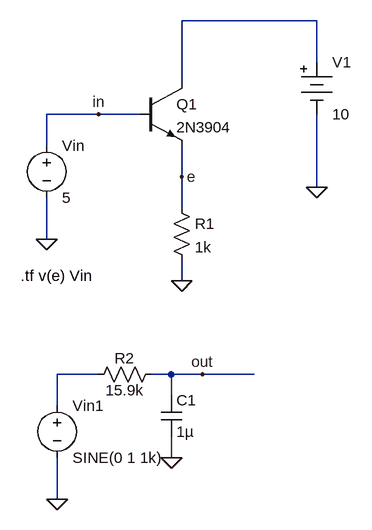
[diagram p0: schematic transfer_function_test.asc]
transfer_function_test.asc, the LTspice schematic file:
Version 4
SHEET 1 880 788
WIRE 448 32 240 32
WIRE 448 96 448 32
WIRE 240 128 240 32
WIRE 112 176 32 176
WIRE 176 176 112 176
WIRE 32 224 32 176
WIRE 240 272 240 224
WIRE 448 288 448 176
WIRE 240 320 240 272
WIRE 32 368 32 304
WIRE 240 432 240 400
WIRE 112 576 48 576
WIRE 224 576 192 576
WIRE 272 576 224 576
WIRE 352 576 272 576
WIRE 224 608 224 576
WIRE 48 624 48 576
WIRE 224 704 224 672
WIRE 48 768 48 704
FLAG 240 432 0
FLAG 448 288 0
FLAG 240 272 e
FLAG 32 368 0
FLAG 224 704 0
FLAG 112 176 in
FLAG 48 768 0
FLAG 272 576 out
SYMBOL npn 176 128 R0
SYMATTR InstName Q1
SYMATTR Value 2N3904
SYMBOL battery 448 80 R0
WINDOW 123 0 0 Left 2
WINDOW 39 0 0 Left 2
SYMATTR InstName V1
SYMATTR Value 10
SYMBOL res 224 304 R0
SYMATTR InstName R1
SYMATTR Value 1k
SYMBOL voltage 32 208 R0
WINDOW 123 0 0 Left 2
WINDOW 39 0 0 Left 2
SYMATTR InstName Vin
SYMATTR Value 5
SYMBOL res 96 592 R270
WINDOW 0 25 56 VTop 2
WINDOW 3 7 56 VBottom 2
SYMATTR InstName R2
SYMATTR Value 15.9k
SYMBOL cap 208 608 R0
SYMATTR InstName C1
SYMATTR Value 1µ
SYMBOL voltage 48 608 R0
WINDOW 123 0 0 Left 2
WINDOW 39 0 0 Left 2
SYMATTR InstName Vin1
SYMATTR Value SINE(0 1 1k)
TEXT -8 424 Left 2 !.tf v(e) Vin

The netlist it stands for:
* transfer_function_test.asc
Q1 N001 in e 0 2N3904
V1 N001 0 10
R1 e 0 1k
Vin in 0 5
R2 N002 out 15.9k
C1 out 0 1µ
Vin1 N002 0 SINE(0 1 1k)
.model NPN NPN
.model PNP PNP
.lib standard.bjt
.tf v(e) Vin
.backanno
.end